# EAGLE design Bipolar 5v Power Supply V1.0 (EAGLE 6.5.0)
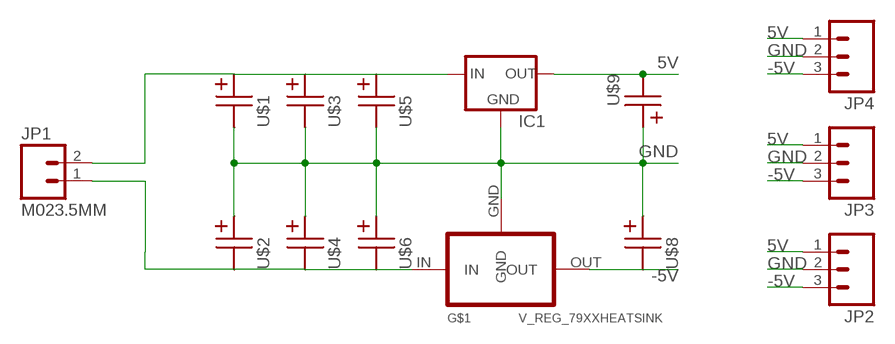
[diagram p0: schematic, sheet 1]

## Parts
IC1  V_REG_78XXSINK  [TO220-IGO]
JP1  M023.5MM  [SCREWTERMINAL-3.5MM-2]
JP2  M03SCREW  [SCREWTERMINAL-3.5MM-3]
JP3  M03SCREW  [SCREWTERMINAL-3.5MM-3]
JP4  M03SCREW  [SCREWTERMINAL-3.5MM-3]
U$1  5MM-12.5MM-POLAR5MMX12.5MM  [5MMLEAD_12.5MMDIAMETER]
U$2  5MM-12.5MM-POLAR5MMX12.5MM  [5MMLEAD_12.5MMDIAMETER]
U$3  5MM-12.5MM-POLAR5MMX12.5MM  [5MMLEAD_12.5MMDIAMETER]
U$4  5MM-12.5MM-POLAR5MMX12.5MM  [5MMLEAD_12.5MMDIAMETER]
U$5  5MM-12.5MM-POLAR5MMX12.5MM  [5MMLEAD_12.5MMDIAMETER]
U$6  5MM-12.5MM-POLAR5MMX12.5MM  [5MMLEAD_12.5MMDIAMETER]
U$7  V_REG_79XXHEATSINK  [TO220-IGO]
U$8  5MM-12.5MM-POLAR2MMX5MM  [2MMLEAD_5MMDIAMETER]
U$9  5MM-12.5MM-POLAR2MMX5MM  [2MMLEAD_5MMDIAMETER]

## Nets
5V: IC1.OUT JP2.1 JP3.1 JP4.1 U$9.+(-)
-5V: JP2.3 JP3.3 JP4.3 U$7.OUT U$8.+(-)
GND: IC1.GND JP2.2 JP3.2 JP4.2 U$1.+(-) U$2.-(+) U$3.+(-) U$4.-(+) U$5.+(-) U$6.-(+) U$7.GND U$8.-(+) U$9.-(+)
RAW+: IC1.IN JP1.2 U$1.-(+) U$3.-(+) U$5.-(+)
RAW-: JP1.1 U$2.+(-) U$4.+(-) U$6.+(-) U$7.IN

## Library data of the parts
IC1 = AMP Library:V_REG_78XX: Voltage Regulator Standard 7805 5V regulator. IGO (Input Ground Output). Spark Fun Electronics SKU : COM-00107
JP1 = SparkFun-Connectors:M02: Standard 2-pin 0.1" header. Use with - straight break away headers ( PRT-00116) - right angle break away headers (PRT-00553) - swiss pins (PRT-00743) - machine pins (PRT-00117) - female headers (PRT-00115) Molex polarized connector foot print use with: PRT-08233 with associated crimp pins and housings. 2.54_SCREWTERM for use with PRT-10571. 3.5mm Screw Terminal footprints for PRT-08084 5mm Screw Terminal footprints for use with PRT-08433
JP2-JP4 = SparkFun-Connectors:M03: Header 3 Standard 3-pin 0.1" header. Use with straight break away headers (SKU : PRT-00116), right angle break away headers (PRT-00553), swiss pins (PRT-00743), machine pins (PRT-00117), and female headers (PRT-00115). Molex polarized connector foot print use with SKU : PRT-08232 with associated crimp pins and housings.
U$1-U$6 U$8 U$9 = AMP Library:5MM-12.5MM-POLAR
U$7 = AMP Library:V_REG_79XX

## Board
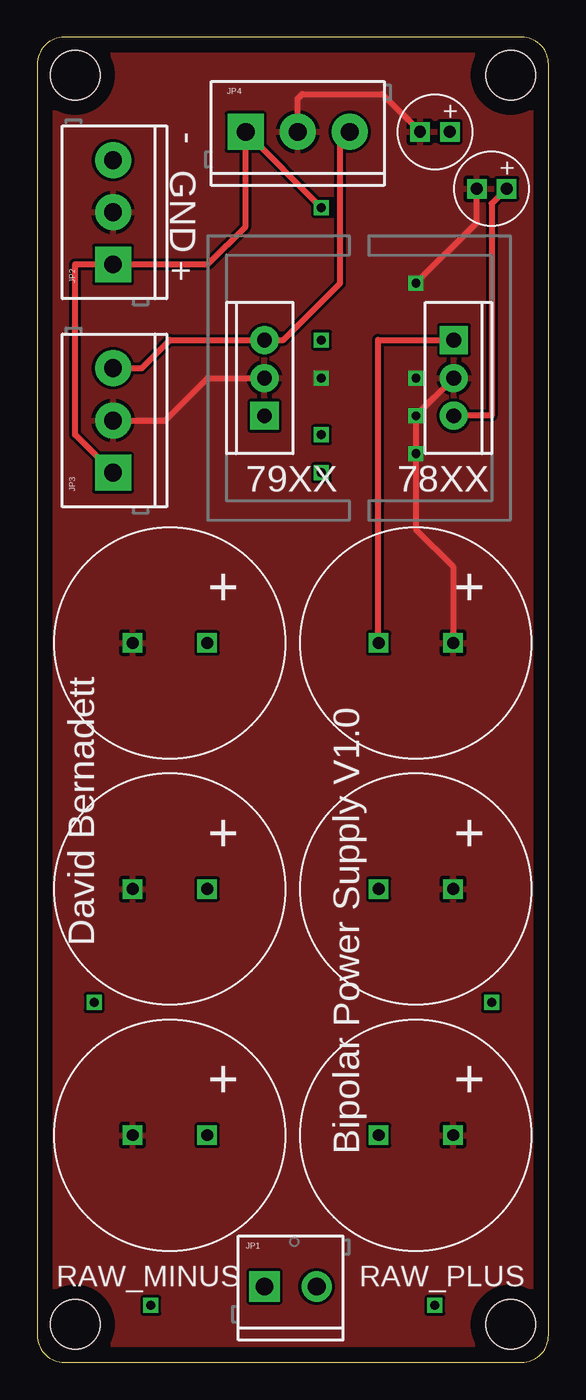
[diagram p1: board, top side]
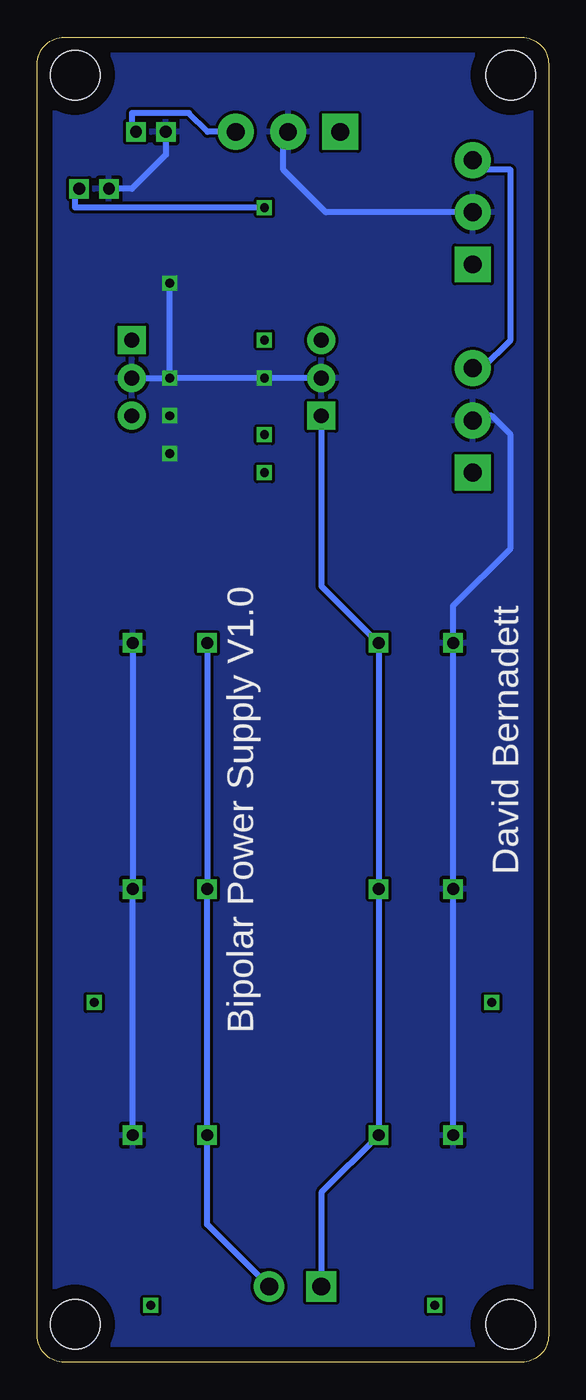
[diagram p2: board, bottom side, seen from below]

Size 34.29 x 88.9 mm. Coordinates in mm from the lower left corner, seen from the top.
Outline: 34.29,1.8 34.29,87.1 arc90 32.49,88.9 1.8,88.9 arc90 0,87.1 0,1.8 arc90 1.8,0 32.49,0 arc90 34.29,1.8
Copper layers (1*16): Top 0.035mm / dielectric 1.5mm / Bottom 0.035mm
Design rules "default": minimum track width 10mil, minimum drill 24mil, track to track 8mil, track to pad 8mil, pad to pad 8mil, via to via 8mil, smd to smd 8mil, copper to edge 40mil, drill to drill 8mil, minimum pad ring 10mil, minimum via ring 8mil, stop-mask expansion 4mil, vias tented up to drill 0mil, thermal gap 10mil

### Footprints (pad centres in the part's own frame; a part is rotated, then mirrored left to right if it is on the bottom)
TO220-IGO = drill 1 pad 1.88: GND 0,0; OUT 2.54,0 | drill 1 pad 1.88 square: IN -2.54,0
SCREWTERMINAL-3.5MM-2 = drill 1.2 pad 2.032 square: 1 0,0 | drill 1.2 pad 2.032: 2 3.5,0
SCREWTERMINAL-3.5MM-3 = drill 1.2 pad 2.413 square: 1 0,0 | drill 1.2 pad 2.413: 2 3.5,0; 3 7,0
5MMLEAD_12.5MMDIAMETER = drill 0.8 square: + 2.5,0; - -2.5,0
2MMLEAD_5MMDIAMETER = drill 0.8 square: + 1,0; - -1,0
STAND-OFF = hole 3.302: 0,0

### Placement (x,y rotation side)
IC1  27.94,66.04 270 top
JP1  15.24,5.08 0 top
JP2  5.08,73.66 90 top
JP3  5.08,59.69 90 top
JP4  13.97,82.55 0 top
U$1  25.4,15.24 0 top
U$2  8.89,15.24 0 top
U$3  25.4,48.26 0 top
U$4  8.89,31.75 0 top
U$5  25.4,31.75 0 top
U$6  8.89,48.26 0 top
U$7  15.24,66.04 90 top
U$8  26.67,82.55 0 top
U$9  30.48,78.74 0 top
U$10  [STAND-OFF]  2.54,2.54 0 top
U$11  [STAND-OFF]  31.75,2.54 0 top
U$12  [STAND-OFF]  2.54,86.36 0 top
U$13  [STAND-OFF]  31.75,86.36 0 top

### Tracks (layer width: path | path; a pad name or v marks a point on that pad's centre or on a via)
5V  (via drill 0.6)
  Top 0.406: JP3.1 2.54,62.23 2.54,73.66 JP2.1 11.43,73.66 13.97,76.2 JP4.1 v19.05,77.47 | U$9.+ 30.48,77.74 30.48,63.5 IC1.OUT
  Bottom 0.406: v19.05,77.47 31.75,77.47 31.75,78.47 U$9.+
-5V
  Top 0.406: JP3.3 7,66.69 8.89,68.58 U$7.OUT 16.51,68.58 20.32,72.39 20.32,81.9 JP4.3
  Bottom 0.406: JP3.3 4.43,66.69 2.54,68.58 2.54,80.01 4.43,80.01 JP2.3 | JP4.3 22.86,82.55 24.13,83.82 27.94,83.82 27.94,82.82 U$8.+
GND  (via drill 0.6)
  Top 0.406: JP3.2 8.58,63.19 11.43,66.04 U$7.GND | JP4.2 17.47,84.78 17.78,85.09 23.13,85.09 U$8.- | IC1.GND v25.4,63.5 v25.4,60.96 25.4,55.88 27.9,53.38 U$3.+ | v25.4,72.39 29.48,76.47 U$9.-
  Bottom 0.406: U$2.- U$4.- U$6.- 6.39,50.76 2.54,54.61 2.54,62.23 3.81,63.5 4.77,63.5 JP3.2 | JP2.2 14.93,77.16 17.78,80.01 17.78,82.24 JP4.2 | U$8.- 25.67,81.01 27.94,78.74 U$9.- | U$7.GND v19.05,66.04 v25.4,66.04 | U$3.+ U$5.+ U$1.+ | IC1.GND v25.4,66.04 | v25.4,66.04 v25.4,72.39
  pour Bottom: 0,88.9 34.29,88.9 34.29,0 0,0
  pour Top: 0,88.9 34.29,88.9 34.29,0 0,0
N$1  (via drill 0.6)
  other vias: 3.81,24.13
N$2  (via drill 0.6)
  other vias: 30.48,24.13
N$3  (via drill 0.6)
  other vias: 7.62,3.81
N$4  (via drill 0.6)
  other vias: 26.67,3.81
N$5  (via drill 0.6)
  other vias: 19.05,59.69
N$6  (via drill 0.6)
  other vias: 19.05,62.23
N$7  (via drill 0.6)
  other vias: 19.05,68.58
RAW+
  Top 0.406: U$3.- 22.86,48.3 22.86,68.58 IC1.IN
  Bottom 0.406: JP1.2 22.9,9.24 U$1.- U$5.- U$3.-
RAW-
  Bottom 0.406: JP1.1 15.24,11.39 U$2.+ U$4.+ U$6.+ 11.43,48.26 15.24,52.07 U$7.IN

### Text on the board
tPlace: - | GND | + | 79XX | 78XX | David Bernadett | Bipolar Power Supply V1.0 | RAW_MINUS | RAW_PLUS
bPlace: Bipolar Power Supply V1.0 | David Bernadett